# EAGLE design Adafruit ItsyBitsy ESP32 (EAGLE 9.6.2)
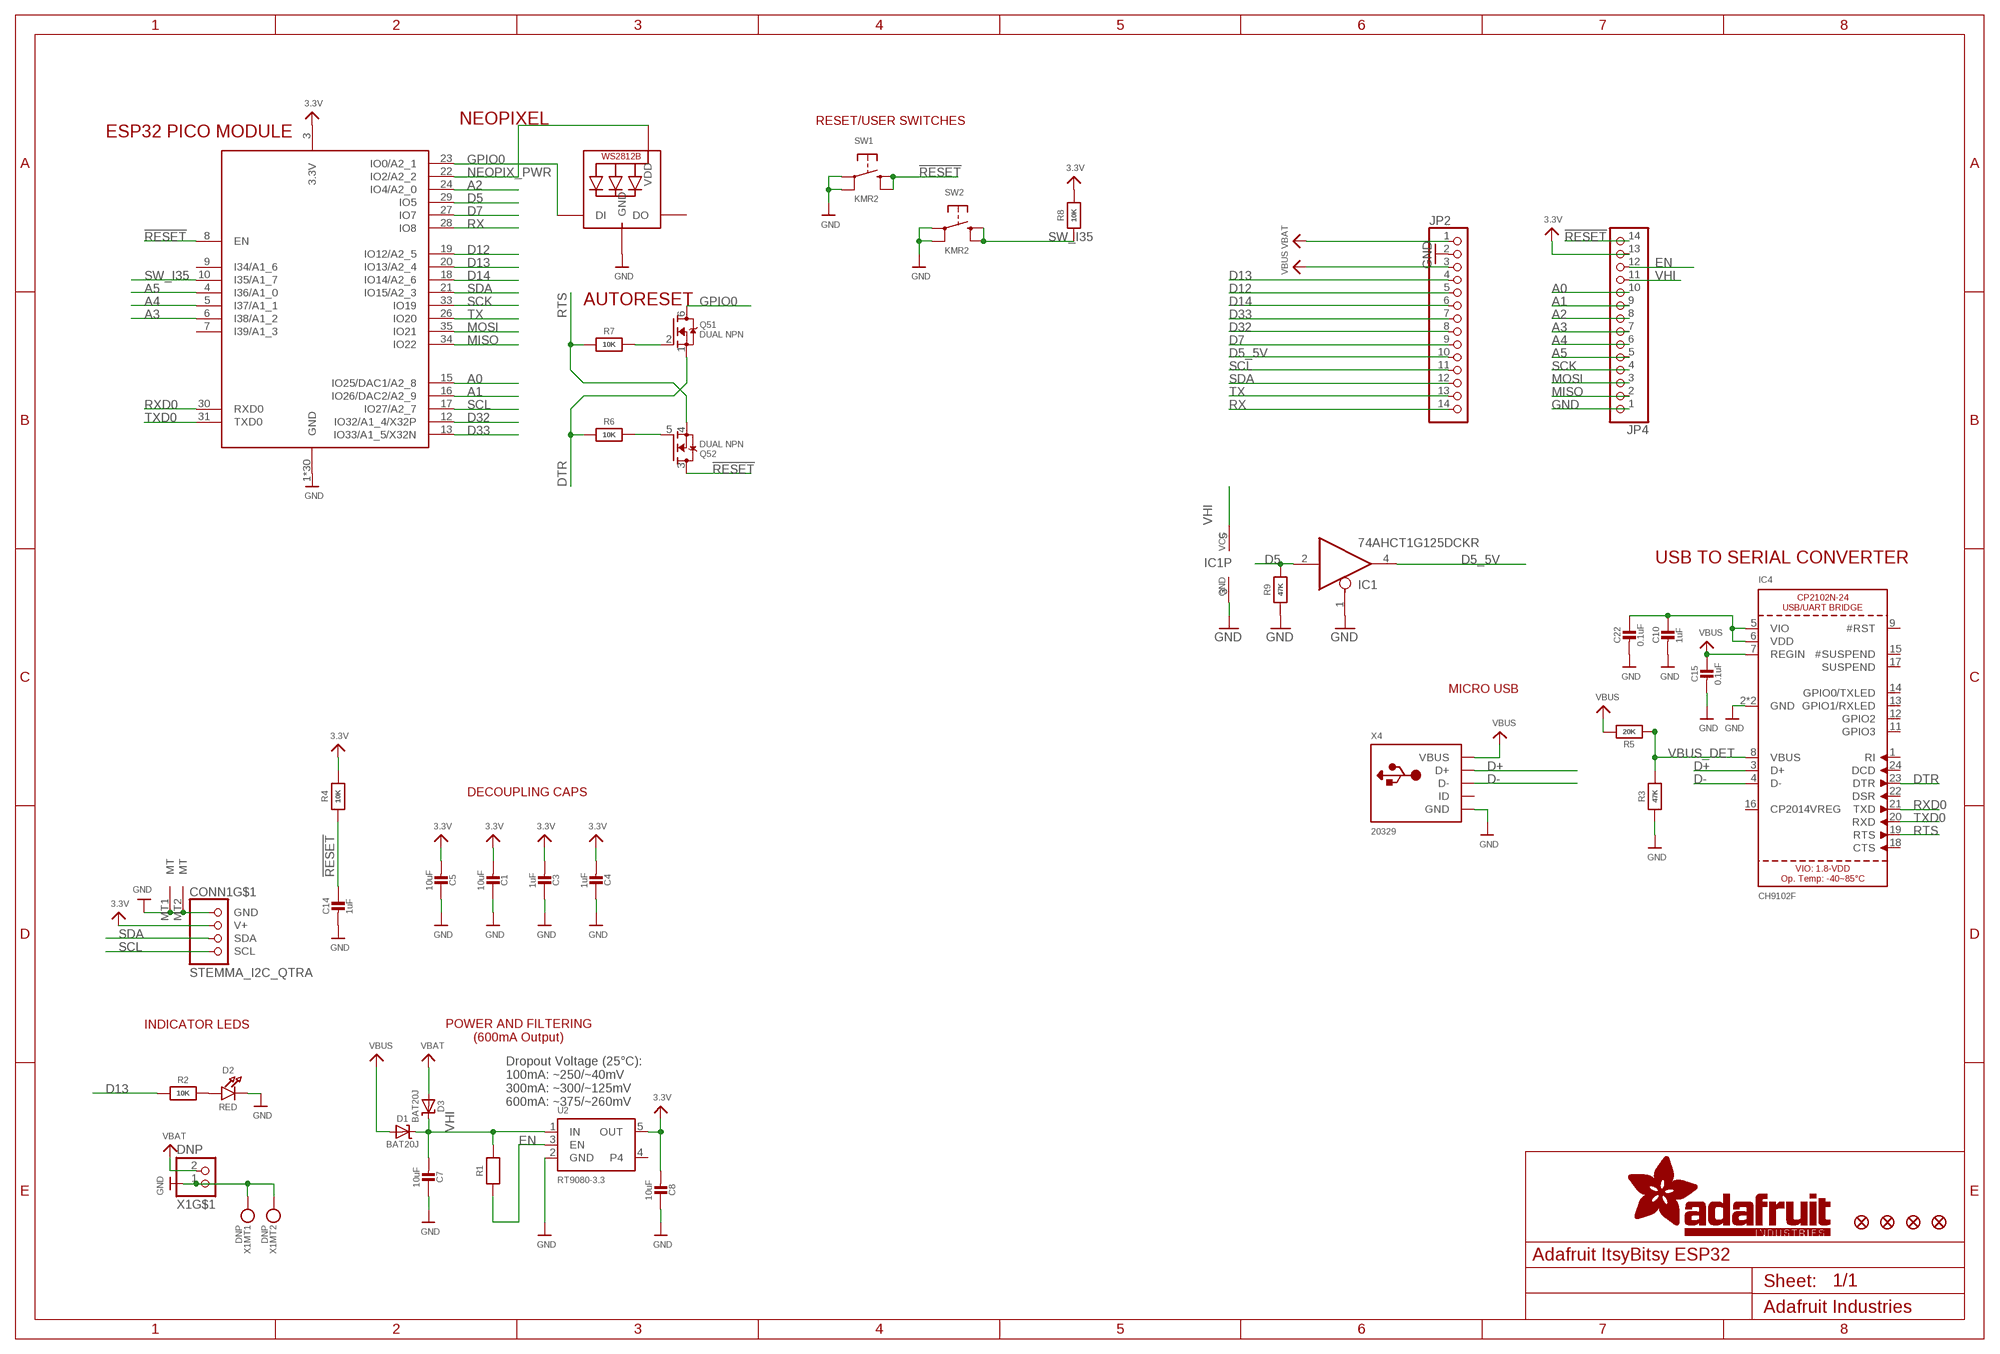
[diagram p0: schematic, sheet 1]

## Parts
C1  10uF  CAP_CERAMIC0805-NOOUTLINE  [0805-NO]
C3  1uF  CAP_CERAMIC0603_NO  [0603-NO]
C4  1uF  CAP_CERAMIC0603_NO  [0603-NO]
C5  10uF  CAP_CERAMIC0805-NOOUTLINE  [0805-NO]
C7  10uF  CAP_CERAMIC0805-NOOUTLINE  [0805-NO]
C8  10uF  CAP_CERAMIC0805-NOOUTLINE  [0805-NO]
C10  1uF  CAP_CERAMIC0603_NO  [0603-NO]
C14  1uF  CAP_CERAMIC0603_NO  [0603-NO]
C15  0.1uF  CAP_CERAMIC0603_NO  [0603-NO]
C22  0.1uF  CAP_CERAMIC0603_NO  [0603-NO]
CONN1  STEMMA_I2C_QTRA  [JST_SH4_RA]
D1  BAT20J  DIODE-SCHOTTKYSOD-323  [SOD-323]
D2  RED  LED0603_NOOUTLINE  [CHIPLED_0603_NOOUTLINE]
D3  BAT20J  DIODE-SCHOTTKYSOD-323  [SOD-323]
FID1  FIDUCIAL_1MM  [FIDUCIAL_1MM]
FID2  FIDUCIAL_1MM  [FIDUCIAL_1MM]
FID3  FIDUCIAL_1MM  [FIDUCIAL_1MM]
FID4  FIDUCIAL_1MM  [FIDUCIAL_1MM]
IC1  74AHCT1G125DCKR  74AHC1G125DCK  [SC70-5]
IC4  CH9102F  CP2102N-24  [QFN24_4MM_SMSC]
JP2  HEADER-1X14  [1X14_ROUND70]
JP4  HEADER-1X14  [1X14_ROUND70]
LED2  WS2812B_SK6805_1515  [SK6805_1515]
Q5  DUAL NPN  MOSFET-N_DUAL  [SOT363]
R1  10K  RESISTOR_0603_NOOUT  [0603-NO]
R2  10K  RESISTOR_0603_NOOUT  [0603-NO]
R3  47K  RESISTOR_0603_NOOUT  [0603-NO]
R4  10K  RESISTOR_0603_NOOUT  [0603-NO]
R5  20K  RESISTOR_0603_NOOUT  [0603-NO]
R6  10K  RESISTOR_0603_NOOUT  [0603-NO]
R7  10K  RESISTOR_0603_NOOUT  [0603-NO]
R8  10K  RESISTOR_0603_NOOUT  [0603-NO]
R9  47K  RESISTOR_0603_NOOUT  [0603-NO]
SW1  KMR2  SWITCH_TACT_SMT_RKB2  [BTN_RKB2_4.6X2.8]
SW2  KMR2  SWITCH_TACT_SMT_RKB2  [BTN_RKB2_4.6X2.8]
U2  RT9080-3.3  VREG_SOT23-5  [SOT23-5]
X1  DNP  CON_JST_PH_2PIN_MT_BATT  [JSTPH2_BATT]
X3  ESP32-PICO-MINI-02MINI  [ESP32-PICO-MINI]
X4  20329  USB_SLIM  [4UCONN_20329_SLIM]

## Nets
3.3V [power]: C1.2 C3.2 C4.2 C5.2 C8.2 CONN1.2(V+) JP4.13 R4.2 R8.2 U2.5(OUT) X3.3(3.3V)
3.45V [power]: C10.1 C22.1 IC4.5(VIO) IC4.6(VDD)
!RESET: C14.1 JP4.14 Q5.3(2:D) R4.1 SW1.B'(S1) SW1.B(S) X3.8(EN)
A0: JP4.10 X3.15(IO25/DAC1/A2_8)
A1: JP4.9 X3.16(IO26/DAC2/A2_9)
A2: JP4.8 X3.24(IO4/A2_0)
A3: JP4.7 X3.6(I38/A1_2)
A4: JP4.6 X3.5(I37/A1_1)
A5: JP4.5 X3.4(I36/A1_0)
D5: IC1.2(I) R9.2 X3.29(IO5)
D5_5V: IC1.4(O) JP2.10
D7: JP2.9 X3.27(IO7)
D12: JP2.5 X3.19(IO12/A2_5)
D13: JP2.4 R2.1 X3.20(IO13/A2_4)
D14: JP2.6 X3.18(IO14/A2_6)
D32: JP2.8 X3.12(IO32/A1_4/X32P)
D33: JP2.7 X3.13(IO33/A1_5/X32N)
D+: IC4.3(D+) X4.D+
D-: IC4.4(D-) X4.D-
DTR: IC4.23(DTR) Q5.1(1:S) R6.1
EN: JP4.12 R1.1 U2.3(EN)
GND: C1.1 C3.1 C4.1 C5.1 C7.1 C8.1 C10.2 C14.2 C15.2 C22.2 CONN1.1(GND) CONN1.MT1(MT) CONN1.MT2(MT) D2.C IC1.1(OE) IC1.3(GND) IC4.2(GND) IC4.THERM(GND) JP2.2 JP4.1 LED2.4(GND) R3.1 R9.1 SW1.A'(P1) SW1.A(P) SW2.A'(P1) SW2.A(P) U2.2(GND) X1.1 X1.NC1 X1.NC2 X3.1(GND) X3.2(GND) X3.11(GND) X3.14(GND) X3.36(GND) X3.37(GND) X3.38(GND) X3.39(GND) X3.40(GND) X3.41(GND) X3.42(GND) X3.43(GND) X3.44(GND) X3.45(GND) X3.46(GND) X3.47(GND) X3.48(GND) X3.49(GND) X3.50(GND) X3.51(GND) X3.52(GND) X3.53(GND) X3.54(GND) X3.55(GND) X3.56(GND) X3.57(GND) X3.58(GND) X3.59(GND) X3.60(GND) X3.61(GND) X4.BASE@1(GND) X4.BASE@2(GND) X4.GND X4.SPRT@1(GND) X4.SPRT@2(GND) X4.SPRT@3(GND) X4.SPRT@4(GND)
GPIO0: LED2.1(DI) Q5.6(1:D) X3.23(IO0/A2_1)
MISO: JP4.2 X3.34(IO22)
MOSI: JP4.3 X3.35(IO21)
N$1: D2.A R2.2
N$7: Q5.5(2:G) R6.2
N$8: Q5.2(1:G) R7.2
NEOPIX_PWR: LED2.2(VDD) X3.22(IO2/A2_2)
RTS: IC4.19(RTS) Q5.4(2:S) R7.1
RX: JP2.14 X3.28(IO8)
RXD0: IC4.21(TXD) X3.30(RXD0)
SCK: JP4.4 X3.33(IO19)
SCL: CONN1.4(SCL) JP2.11 X3.17(IO27/A2_7)
SDA: CONN1.3(SDA) JP2.12 X3.21(IO15/A2_3)
SW_I35: R8.1 SW2.B'(S1) SW2.B(S) X3.10(I35/A1_7)
TX: JP2.13 X3.26(IO20)
TXD0: IC4.20(RXD) X3.31(TXD0)
VBAT [power]: D3.A JP2.1 X1.2
VBUS [power]: C15.1 D1.A IC4.7(REGIN) JP2.3 R5.2 X4.VBUS
VBUS_DET: IC4.8(VBUS) R3.2 R5.1
VHI [power]: C7.2 D1.C D3.C IC1.5(VCC) JP4.11 R1.2 U2.1(IN)
Unconnected: IC4.1(RI) IC4.9(#RST) IC4.11(GPIO3) IC4.12(GPIO2) IC4.13(GPIO1/RXLED) IC4.14(GPIO0/TXLED) IC4.15(#SUSPEND) IC4.16(CP2014VREG) IC4.17(SUSPEND) IC4.18(CTS) IC4.22(DSR) IC4.24(DCD) LED2.3(DO) U2.4 X3.7(I39/A1_3) X3.9(I34/A1_6) X4.ID

## Notes on the sheet
- NEOPIXEL | RESET/USER SWITCHES
- ESP32 PICO MODULE
- AUTORESET
- USB TO SERIAL CONVERTER
- MICRO USB
- DECOUPLING CAPS
- INDICATOR LEDS
- POWER AND FILTERING
  (600mA Output)
- Dropout Voltage (25°C):
  100mA: ~250/~40mV
  300mA: ~300/~125mV
  600mA: ~375/~260mV

## Library data of the parts
C1 C3-C5 C7 C8 C10 C14 C15 C22 = microbuilder:CAP_CERAMIC: Ceramic Capacitors For new designs, use the packages preceded by an '_' character since they are more reliable: The following footprints should be used on most boards: _0402 - Standard footprint for regular board layouts _0603 - Standard footprint for regular board layouts _0805 - Standard footprint for regular board layouts _1206 - Standard footprint for regular board layouts For extremely tight-pitch boards where space is at a premium, the following 'micro-pitch' footprints can be used (smaller pads, no silkscreen outline, etc.): _0402MP - Micro-pitch footprint for very dense/compact boards _0603MP - Micro-pitch footprint for very dense/compact boards _0805MP - Micro-pitch footprint for very dense/compact boards _1206MP - Micro-pitch footprint for very dense/compact boards
CONN1 = adafruit_electromech:STEMMA_I2C; LCSC: C145961
D1 D3 = microbuilder:DIODE-SCHOTTKY
D2 = microbuilder:LED: LED 0603 - 0603 Surface Mount Package 2mA: Green LED - Low Power (3.9mcd, 2ma, 1.7Vf) - Digikey: 475-2709-2-ND Orange LED - Low Power (9.8mcd, 2ma, 1.8Vf) - Digikey: 475-1194-2-ND Red LED - Low Power (5mcd, 2ma, 1.8Vf) - Digikey: 475-1195-2-ND Yellow LED - Low Power (7mcd, 2ma, 1.8Vf) - Digikey: 475-1196-2-ND 5mA: Blue LED - Low Power (17mcd, 5ma, 2.9Vf) - Digikey: LNJ937W8CRACT-ND 0805 - 0805 Surface Mount Package 2mA: Red LED (8.8mcd, 2mA, 1.8Vf, Clear) - Low Power [Digikey: 475-2510-1-ND] Green LED (5mcd, 2mA, 1.8Vf, Clear) - Low Power [Digikey: 475-2730-1-ND] Yellow LED (11.3mcd, 2mA, 1.8Vf, Clear) - Low Power [Digikey: 475-2555-1-ND] 20mA: Red LED (104mcd, 20mA, Diffused) - LS R976 [Digikey: 475-1278-6-ND] Red LED (12mcd, 20mA, 2.0Vf, Clear) - APT2012EC [Digikey: 754-1128-1-ND] Green LED (15mcd, 20mA, 2.2Vf, Clear) - APT2012GC [Digikey: 754-1131-1-ND] Orange LED (160mcd, 20mA, 2.1Vf, Clear) - APT2012SECK [Digikey: 754-1130-1-ND] 1206 - 1206 Surface Mount Package Green LED (26mcd, 20mA, Diffused) - LG N971 [Digikey: 475-1407-6-ND] Red LED (15mcd, 20mA, Diffused) - LH N974 [Digikey: 475-1416-6-ND] Cree - Cree High-Power Surface Mount LEDs XPEBWT-L1-0000-00D50 - White 111lm 350mA 2.9Vf 6200K 110° XTEAWT-00-0000-00000LEE3 - White 114lm 350mA 2.85Vf 5000K 115° Everlight - Everlight 45-21 Series Surface Mount LEDs 45-21/QK2C-B2832AC2CB2/2T - Warm White 2000mcd 20mA 3.25Vf 3050K 120° 45-21/LK2C-B38452C4CB2/2T - Nuetral White 2000mcd 20mA 3.25Vf 4150K 120° 45-21/LK2C-B50634C6CB2/2T - Cold White 2200mcd 20mA 3.25Vf 5650K 120° PLCC2 Reverse Mount LS T77K-J1L2-1-0-2-R18-Z - Red 11.25mcd 2mA 1.8Vf 630nm 120° LO T77K-L1M2-24-Z - Orange 19.6mcd 2mA 1.8Vf 606nm 120° LY T77K-K2M1-26-Z - Yellow 15.7mcd 2mA 1.8Vf 587nm 120°; ROT: 270
FID1-FID4 = microbuilder:FIDUCIAL: Fiducial Alignment Points Various fiducial points for machine vision alignment.; BOM: EXCLUDE
IC1 = 74xx-little-us:74*1G125: Single Bus Buffer Gate with 3-State Output
IC4 = microbuilder:CP2102N-24; JLC_ROTATION: 270
JP2 JP4 = microbuilder:HEADER-1X14
LED2 = microbuilder:WS2812B; LCSC: C2890035
Q5 = microbuilder:MOSFET-N_DUAL: Dual N-Channel MOSFET SOT363 (2.0x1.25mm) 2N7002PS - 60V, 320mA [Digikey: 568-5984-1-ND]; JLC_ROTATION: 0
R1-R9 = microbuilder:RESISTOR: Resistors For new designs, use the packages preceded by an '_' character since they are more reliable: The following footprints should be used on most boards: _0402 - Standard footprint for regular board layouts _0603 - Standard footprint for regular board layouts _0805 - Standard footprint for regular board layouts _1206 - Standard footprint for regular board layouts For extremely tight-pitch boards where space is at a premium, the following 'micro-pitch' footprints can be used (smaller pads, no silkscreen outline, etc.): _0402MP - Micro-pitch footprint for very dense/compact boards _0603MP - Micro-pitch footprint for very dense/compact boards _0805MP - Micro-pitch footprint for very dense/compact boards _1206MP - Micro-pitch footprint for very dense/compact boards
SW1 SW2 = adafruit_electromech:SWITCH_TACT_SMT: SMT Tact Switches RKB2 https://www.digikey.com/short/m027prz5
U2 = adafruit_power:VREG_SOT23-5: SOT23-5 Fixed Voltage Regulators Part Current Out V Out V In V Dropout θJA (°C/W) TJ (°C) Digikey Part No. ADP121 150mA 3.3V 3.4-5.5V 0.09V @ 150mA -- -- ADP121-AUJZ33R7CT-ND ADP121 150mA 3.0V 3.1-5.5V 0.09V @ 150mA -- -- ADP121-AUJZ30R7CT-ND ADP122 300mA 3.3V 3.4-5.5V 0.085V @ 300mA -- -- ADP122AUJZ-3.3-R7CT-ND ADP1712 300mA 3.3V 3.5-5.5V 0.17V @ 300mA -- -- ADP1712AUJZ-3.3-R7TR-ND AP7311 (Low Cost) 150mA 3.3V 3.5-6V 0.15V @ 150mA -- -- AP7311-33WG-7DICT-ND LD39015M18R 150mA 1.8V 1.9V-5.5V 0.08V @ 100mA -- -- 497-6977-1-ND LP2985A-33DBVR 150mA 3.3V 3.3-16V 0.28V @ 150mA 206 150 296-18479-1-ND MCP1824T-3302E/OT 300mA 3.3V 3.5V-6V 0.2V @ 300mA -- -- MCP1824T-3302E/OTCT-ND MIC5205-2.5YM5 TR 150mA 2.5V 2.7-16V 0.165V @ 150mA -- -- 576-1257-2-ND MIC5205-3.0YM5 TR 150mA 3.0V 3.2V-16V 0.165V @ 150mA -- -- 576-1258-2-ND MIC5205-3.3YM5 TR 150mA 3.3V 3.5V-16V 0.165V @ 150mA -- -- 576-1259-2-ND TPS780330220 150mA 3.3V+2.2V 3.6-5.5V 250mV Max -- -- 296-23332-1-ND TDA3663/N1,135 100mA 3.3V 3.5-45V 0.18V @ 50mA -- -- 568-5343-1-ND Max operating temp can be calculated using θJA, TJ (max junction temperature), and power in watts. Set the "Maximum Ambient Temperature" until it reaches TJ ("Max Junction Temperature"), which is the absolute limit for safe use of the regulator: Heat Sink Temperature Calculator <http://www.daycounter.com/Calculators/Heat-Sink-Temperature-Calculator.phtml> For example, With 12V source into a 3.3V LP2985 and a 30mA load, we are dissipating (12V-3.3V) * 0.03A = 0.261W. With a θJA of 206 °C/W, a TJ of 150°C, and 261mW we can safely use the chip without a heat sink up to 75°C (=147.1°C Junction Temperature).; JLC_ROTATION: 0
X1 = adafruit_electromech:CON_JST_PH_2PIN_MT; LCSC: C47647
X3 = adafruit_wireless:ESP32-PICO-MINI-02
X4 = adafruit_electromech:USB: USB Connectors USBMINIB - Surface Mount Female Mini-B USB Connector 4UConnector: 06564

## Net classes
1 power: width 0.305 mm

## Board
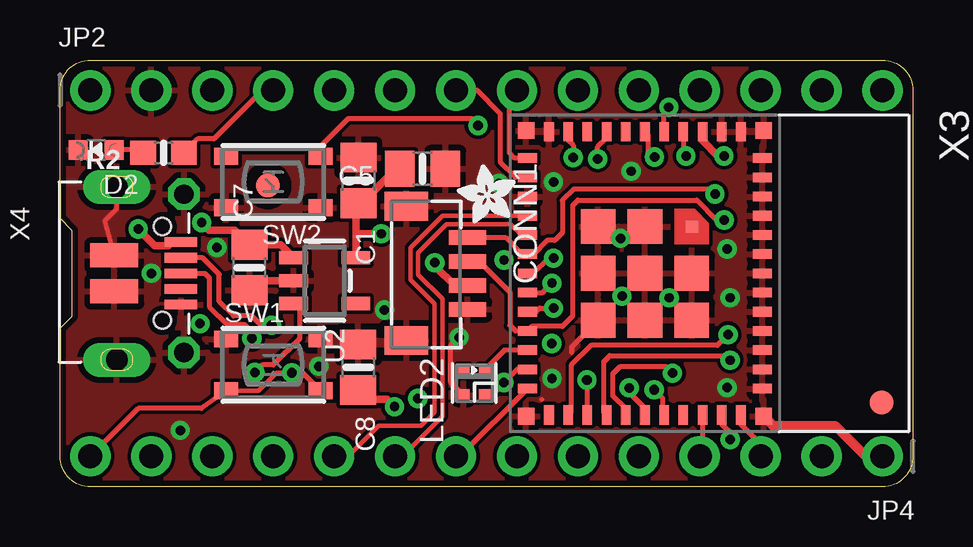
[diagram p1: board, top side]
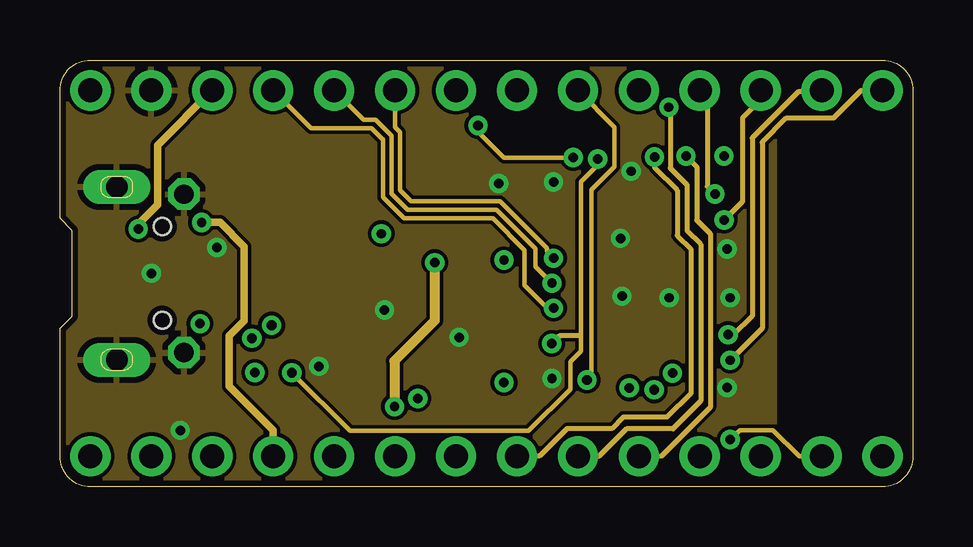
[diagram p2: board, inner layer Route2]
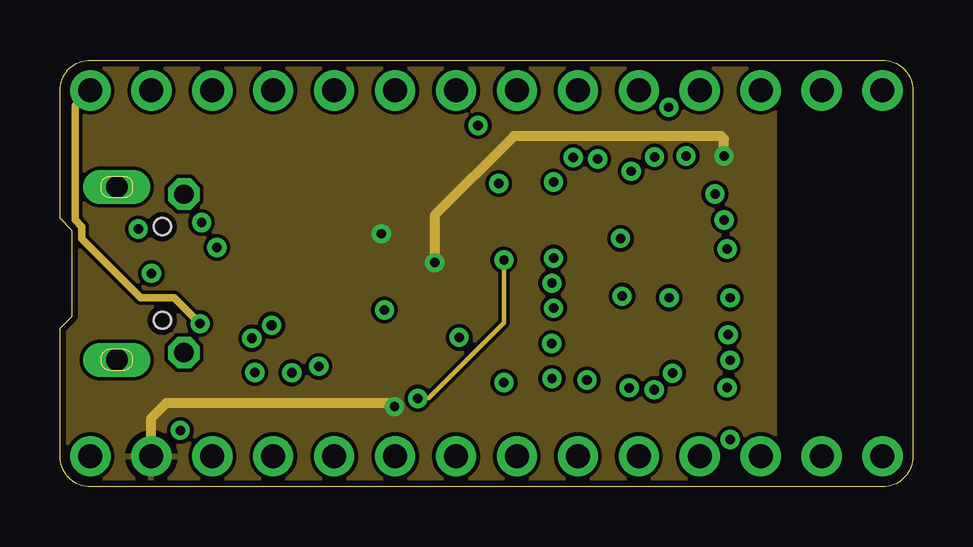
[diagram p3: board, inner layer Route15]
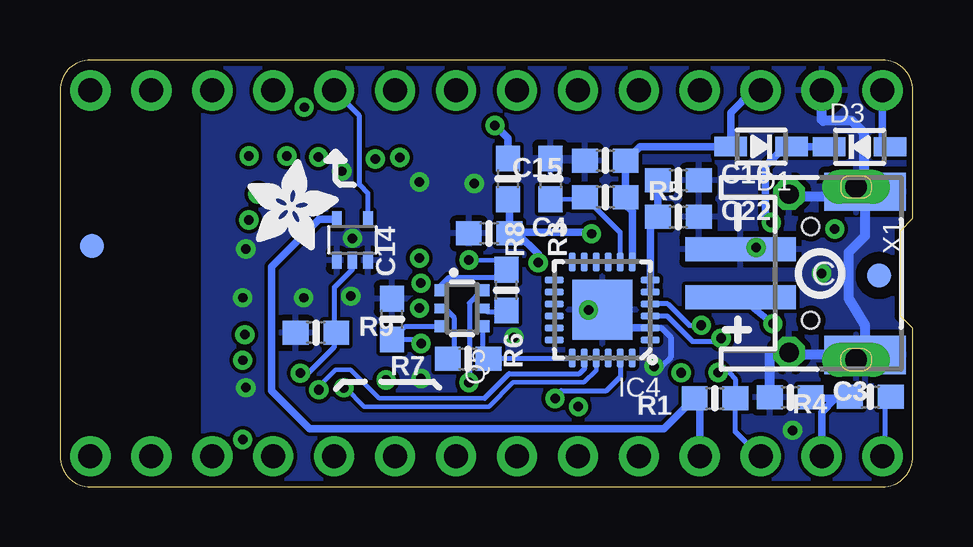
[diagram p4: board, bottom side, seen from below]

Size 35.56 x 17.78 mm. Coordinates in mm from the lower left corner, seen from the top.
Outline: 0,11.18 0,16.51 arc-90 1.27,17.78 34.29,17.78 arc-90 35.56,16.51 35.56,1.27 arc-90 34.29,0 1.27,0 arc-90 0,1.27 0,6.6 0.51,7.11 0.51,10.67 0,11.18
Copper layers (1+2*15+16): Top 0.035mm / dielectric 0.2mm / Route2 0.035mm / dielectric 1.45mm / Route15 0.035mm / dielectric 0.2mm / Bottom 0.035mm
Design rules "adafruit_4layer *": minimum track width 7mil, minimum drill 15.5mil, track to track 6mil, track to pad 6mil, pad to pad 6mil, via to via 6mil, smd to smd 6mil, copper to edge 10mil, drill to drill 8mil, minimum pad ring 10mil, minimum via ring 8mil, stop-mask expansion 2mil, vias tented up to drill 20mil, thermal gap 10mil

### Footprints (pad centres in the part's own frame; a part is rotated, then mirrored left to right if it is on the bottom)
0805-NO = smd 1.24 x 1.5: 1 -0.95,0; 2 0.95,0
0603-NO = smd 1.075 x 1: 1 -0.85,0; 2 0.85,0
JST_SH4_RA = smd 0.6 x 1.55: 1 1.5,0.924; 2 0.5,0.924; 3 -0.5,0.924; 4 -1.5,0.924 | smd 1.2 x 1.8: MT1 -2.8,-1.624; MT2 2.8,-1.624
SOD-323 = smd 1.35 x 0.8: A 1.27,0; C -1.27,0
CHIPLED_0603_NOOUTLINE = smd 0.8 x 0.8: A 0,-0.75; C 0,0.75
FIDUCIAL_1MM = smd 1 x 1: 1 0,0
SC70-5 = smd 0.4 x 0.7: 1 -0.65,-0.85; 2 0,-0.85; 3 0.65,-0.85; 4 0.65,0.85; 5 -0.65,0.85
QFN24_4MM_SMSC = smd 0.8 x 0.28: 1 -2,1.25; 2 -2,0.75; 3 -2,0.25; 4 -2,-0.25; 5 -2,-0.75; 6 -2,-1.25; 13 2,-1.25; 14 2,-0.75; 15 2,-0.25; 16 2,0.25; 17 2,0.75; 18 2,1.25 | smd 0.28 x 0.8: 7 -1.25,-2; 8 -0.75,-2; 9 -0.25,-2; 10 0.25,-2; 11 0.75,-2; 12 1.25,-2; 19 1.25,2; 20 0.75,2; 21 0.25,2; 22 -0.25,2; 23 -0.75,2; 24 -1.25,2 | smd 2.5 x 2.5: THERM 0,0
1X14_ROUND70 = drill 1 pad 1.676: 1 -16.51,0; 2 -13.97,0; 3 -11.43,0; 4 -8.89,0; 5 -6.35,0; 6 -3.81,0; 7 -1.27,0; 8 1.27,0; 9 3.81,0; 10 6.35,0; 11 8.89,0; 12 11.43,0; 13 13.97,0; 14 16.51,0
SK6805_1515 = smd 0.5 x 0.5: 1 -0.5,-0.45; 2 0.5,-0.45; 3 0.5,0.45; 4 -0.5,0.45
SOT363 = smd 0.5 x 0.5: 1 -0.75,-0.9; 3 0.75,-0.9; 4 0.75,0.9; 6 -0.75,0.9 | smd 0.4 x 0.5: 2 0,-0.9; 5 0,0.9
BTN_RKB2_4.6X2.8 = smd 1 x 0.7: A 1.973,1.075; A' -1.973,1.075; B 1.973,-1.075; B' -1.973,-1.075
SOT23-5 = smd 0.55 x 1.2: 1 -0.95,-1.3; 2 0,-1.3; 3 0.95,-1.3; 4 0.95,1.3; 5 -0.95,1.3
JSTPH2_BATT = smd 1 x 4.6: 1 -1,-2.303; 2 1,-2.303 | smd 1.6 x 3.4: NC1 -3.4,2.897; NC2 3.4,2.897
ESP32-PICO-MINI = smd 0.8 x 0.4: 1 -5.9,4; 2 -5.9,3.2; 3 -5.9,2.4; 4 -5.9,1.6; 5 -5.9,0.8; 6 -5.9,0; 7 -5.9,-0.8; 8 -5.9,-1.6; 9 -5.9,-2.4; 10 -5.9,-3.2; 11 -5.9,-4; 25 5.9,-4; 26 5.9,-3.2; 27 5.9,-2.4; 28 5.9,-1.6; 29 5.9,-0.8; 30 5.9,0; 31 5.9,0.8; 32 5.9,1.6; 33 5.9,2.4; 34 5.9,3.2; 35 5.9,4 | smd 0.4 x 0.8: 12 -4.8,-4.9; 13 -4,-4.9; 14 -3.2,-4.9; 15 -2.4,-4.9; 16 -1.6,-4.9; 17 -0.8,-4.9; 18 0,-4.9; 19 0.8,-4.9; 20 1.6,-4.9; 21 2.4,-4.9; 22 3.2,-4.9; 23 4,-4.9; 24 4.8,-4.9; 36 4.8,4.9; 37 4,4.9; 38 3.2,4.9; 39 2.4,4.9; 40 1.6,4.9; 41 0.8,4.9; 42 0,4.9; 43 -0.8,4.9; 44 -1.6,4.9; 45 -2.4,4.9; 46 -3.2,4.9; 47 -4,4.9; 48 -4.8,4.9 | smd 1.45 x 1.45: 49 0,0; 54 -1.95,0; 55 -1.95,-1.95; 56 0,-1.95; 57 1.95,-1.95; 58 1.95,0; 59 1.95,1.95; 60 0,1.95 | smd 0.7 x 0.7: 50 5.95,4.95; 51 5.95,-4.95; 52 -5.95,-4.95; 53 -5.95,4.95 | smd 0.5 x 0.5: 61 -1.95,1.95
4UCONN_20329_SLIM = smd 1 x 2: BASE@1 -0.75,-1.492; BASE@2 0.75,-1.492 | smd 0.4 x 1.35: D+ 0,1.283; D- -0.65,1.283; GND 1.3,1.283; ID 0.65,1.283; VBUS -1.3,1.283 | drill 0.8 pad 1.27 octagon: SPRT@1 -3.3,1.408; SPRT@2 3.3,1.408 | drill 0.9 pad 1.27 long: SPRT@3 -3.6,-1.392; SPRT@4 3.6,-1.392 | hole 0.7: -1.95,0.508; 1.95,0.508

### Placement (x,y rotation side)
C1  12.45,12.76 270 top
C3  5.12,3.72 0 bottom
C4  17.67,10.55 0 bottom
C5  15.11,13.25 180 top
C7  7.9,9.13 90 top
C8  12.43,4.98 270 top
C10  9.78,12.76 0 bottom
C14  21.72,6.99 90 bottom
C15  12.83,13.59 180 bottom
C22  9.78,11.24 0 bottom
CONN1  16.07,8.89 270 top
D1  6.32,14.17 180 bottom
D2  1.51,14.03 90 top
D3  2.22,14.16 0 bottom
E$1  [ADAFRUIT_2.5MM]  18.99,10.99 90 top
E$2  [ADAFRUIT_3.5MM]  27.75,9.84 0 bottom
FID1  34.25,3.52 0 top
FID2  8.66,12.55 0 top
FID3  34.23,10.03 0 bottom
FID4  1.41,8.8 0 bottom
IC1  23.37,10.29 0 bottom
IC4  12.95,7.37 180 bottom
JP2  17.78,16.51 0 top
JP4  17.78,1.27 180 top
LED2  17.27,4.32 90 top
PLABEL0  [PLABEL0]  0.38,2.92 0 top
PLABEL1  [PLABEL1]  3.05,2.79 0 top
PLABEL2  [PLABEL2]  5.59,2.86 0 top
PLABEL3  [PLABEL3]  7.87,2.86 0 top
PLABEL4  [PLABEL4]  10.67,2.79 0 top
PLABEL5  [PLABEL5]  13.21,2.86 0 top
PLABEL6  [PLABEL6]  15.68,2.86 0 top
PLABEL7  [PLABEL7]  0.25,15.05 0 top
PLABEL8  [PLABEL8]  3.3,15.05 0 top
PLABEL9  [PLABEL9]  5.08,15.05 0 top
PLABEL10  [PLABEL10]  8.19,14.99 0 top
PLABEL11  [PLABEL11]  10.79,14.99 0 top
PLABEL12  [PLABEL12]  13.21,14.73 0 top
PLABEL13  [PLABEL13]  15.68,14.8 0 top
PLABEL14  [PLABEL14]  17.46,14.86 0 top
PLABEL15  [PLABEL15]  17.4,2.86 0 top
PLABEL16  [PLABEL16]  4.57,4.25 0 top
PLABEL17  [PLABEL17]  5.84,12.7 0 top
PLABEL18  [PLABEL18]  16.89,6.22 0 top
PLABEL19  [PLABEL19]  14.16,4.7 0 top
PLABEL20  [PLABEL20]  18.35,7.11 90 top
PLABEL21  [PLABEL21]  19.05,2.67 90 bottom
PLABEL22  [PLABEL22]  21.59,2.54 90 bottom
PLABEL23  [PLABEL23]  24.13,2.54 90 bottom
PLABEL24  [PLABEL24]  26.67,2.54 90 bottom
PLABEL25  [PLABEL25]  29.21,2.54 90 bottom
PLABEL26  [PLABEL26]  31.75,2.54 90 bottom
PLABEL27  [PLABEL27]  34.29,2.54 90 bottom
PLABEL28  [PLABEL28]  21.59,14.54 90 bottom
PLABEL29  [PLABEL29]  24.13,14.22 90 bottom
PLABEL30  [PLABEL30]  26.8,13.53 90 bottom
PLABEL31  [PLABEL31]  29.21,13.14 90 bottom
PLABEL32  [PLABEL32]  31.75,13.97 90 bottom
PLABEL33  [PLABEL33]  34.29,13.91 90 bottom
PLABEL34  [PLABEL34]  16.51,2.54 90 bottom
PLABEL35  [PLABEL35]  11.43,2.54 90 bottom
PLABEL36  [PLABEL36]  13.97,2.54 90 bottom
PLABEL37  [PLABEL37]  19.05,13.84 90 bottom
PLABEL38  [PLABEL38]  17.21,14.86 0 bottom
PLABEL39  [PLABEL39]  14.67,14.73 0 bottom
PLABEL40  [PLABEL40]  12.13,14.8 0 bottom
PLABEL41  [PLABEL41]  9.72,14.8 0 bottom
PLABEL42  [PLABEL42]  21.15,12.57 0 bottom
PLABEL43  [PLABEL43]  21.97,5.21 0 bottom
PLABEL44  [PLABEL44]  30.73,9.84 0 bottom
Q5  18.8,7.43 270 bottom
R1  8.26,3.68 180 bottom
R2  4.32,13.92 180 top
R3  15.11,12.83 270 bottom
R4  1.78,3.75 180 bottom
R5  12.83,12.06 0 bottom
R6  16.95,8.19 270 bottom
R7  18.54,5.33 180 bottom
R8  16.89,12.83 270 bottom
R9  24.89,6.41 0 bottom
SW1  8.89,5.08 0 top
SW2  8.89,12.7 180 top
U2  11.04,8.59 270 top
U$16  [PCBFEAT-REV-040]  3.87,8.89 0 bottom
X1  4.89,8.89 270 bottom
X3  24.38,8.89 270 top
X4  3.76,8.89 270 top

### Tracks (layer width: path | path; a pad name or v marks a point on that pad's centre or on a via)
3.3V  (via drill 0.39)
  Top 0.305: X3.3 26.78,14.43 27.43,13.78 v27.68,13.78 | v15.62,9.34 15.62,9.21 16.48,8.35 16.48,8.39 CONN1.2 | C5.2 13.88,12.96 13.72,12.96 12.57,11.81 C1.2 12.46,11.8 12.34,11.67 U2.5 12.34,10.36 12.52,10.54 v13.4,10.54 | v13.95,3.33 13.63,3.65 12.81,3.65 C8.2
  Route2 0.406: v15.62,9.34 15.62,6.92 13.95,5.25 v13.95,3.33
  Route15 0.406: v27.68,13.78 27.68,14.48 27.56,14.61 18.92,14.61 15.62,11.3 v15.62,9.34 | JP4.13 3.81,2.86 4.45,3.49 13.79,3.49 v13.95,3.33
  Bottom 0.305: 2.63,3.68 R4.2 3.17,3.75 3.24,3.68 | 3.24,3.68 3.81,3.11 JP4.13 | C3.2 4.23,3.68 3.24,3.68 | C4.2 16.5,10.55 15.62,9.68 v15.62,9.34 | C4.2 16.77,10.6 13.46,10.6 v13.4,10.54 | R8.2 16.82,11.9 C4.2
  pour Route15: 0.13,17.78 29.78,17.78 29.78,-0.06 0.13,-0.06 0.13,17.72
3.45V
  Bottom 0.305: IC4.5 IC4.6 10.95,10.91 C22.1 C10.1
!RESET  (via drill 0.39, 0.4)
  Top 0.178: SW1.B' 8.28,4 9.03,4.75 v9.66,4.75
  Top 0.203: SW1.B' 5.89,3.26 3.26,3.26 JP4.14 | v22.42,13.65 22.42,14.16 22.78,14.53 X3.8 | SW1.B 10.12,4.75 v9.66,4.75
  Route2 0.178: v22.42,13.65 22.42,13.4 21.72,12.7 21.72,6.29 21.72,5.65 21.27,5.21 21.27,4.06 19.54,2.32 12.09,2.32 v9.66,4.75
  Route2 0.203: v20.5,5.97 20.82,6.29 21.72,6.29
  Bottom 0.203: Q5.3 21.17,6.68 C14.1 20.67,6.13 v20.5,5.97 | R4.1 1.18,3.49 1.18,1.36 JP4.14
A0
  Top 0.178: JP4.10 12,1.27 13.27,2.54 15.05,2.54 15.61,3.1 15.61,7.63 14.61,8.63 14.61,9.95 15.94,11.29 X3.15
A1
  Top 0.178: X3.16 19.23,10.49 18.79,10.93 16.11,10.93 14.94,9.75 14.94,8.84 15.94,7.83 15.94,2.93 14.28,1.27 JP4.9
A2
  Top 0.203: JP4.8 16.66,1.27 X3.24
A3  (via drill 0.39)
  Top 0.203: X3.6 24.51,14.66 24.51,14.01 v24.78,13.74
  Route2 0.178: v24.78,13.74 24.78,13.29
  Route2 0.203: 24.78,13.29 25.74,12.34 25.74,10.47 26.3,9.91 26.3,3.88 25.31,2.9 23.48,2.9 23,2.43 21.14,2.43 19.98,1.27 JP4.7
A4  (via drill 0.39)
  Top 0.203: v25.38,15.81 25.18,15.62 X3.5
  Route2 0.203: JP4.6 22.48,1.27 23.62,2.41 25.55,2.41 26.71,3.58 26.71,10.1 26.14,10.67 26.14,12.57 25.44,13.27 25.44,15.75 v25.38,15.81
A5  (via drill 0.39)
  Top 0.203: X3.4 25.98,13.89 v26.1,13.78
  Route2 0.178: JP4.5 25.08,1.27
  Route2 0.203: v26.1,13.78 26.54,13.34 26.54,11.11 27.11,10.54 27.11,3.3 25.08,1.27
D5  (via drill 0.39)
  Top 0.203: X3.29 23.58,3.24 23.05,3.78 23.05,4.7 23.37,5.02 25.25,5.02 v25.54,4.73
  Bottom 0.178: v25.54,4.73 25.22,4.73 | R9.2 24.13,6.5
  Bottom 0.203: 25.22,4.73 24.13,5.82 24.13,6.5 24.13,8.3 23.37,9.06 IC1.2
D5_5V
  Bottom 0.203: IC1.4 22.72,12.22 23.1,12.6 23.1,15.48 JP2.10
D7  (via drill 0.4)
  Top 0.203: X3.27 21.98,4.43 v21.97,4.45
  Route2 0.178: JP2.9 23.11,14.99 23.11,13.34 22.16,12.38 22.16,4.64 v21.97,4.45
D12  (via drill 0.39)
  Top 0.203: X3.19 20.12,8.09 v20.51,8.48
  Route2 0.178: v20.51,8.48 19.82,9.18 19.82,9.91 18.19,11.53 14.5,11.53 13.82,12.21 13.82,14.62 13.16,15.28 12.66,15.28 JP2.5
D13  (via drill 0.39)
  Top 0.203: X3.20 19.85,7.29 20,7.44 v20.57,7.44 | JP2.4 8.45,16.51 6.43,14.49 5.74,14.49 R2.1
  Route2 0.178: 20.32,7.44 19.37,8.39 19.37,9.86 18.05,11.18 14.35,11.18 13.46,12.06 13.46,14.48 13.44,14.48 12.99,14.93 10.47,14.93 JP2.4
  Route2 0.203: v20.57,7.44 20.32,7.44
D14  (via drill 0.39)
  Top 0.203: v20.57,9.53 20.38,9.53 19.75,8.89 X3.18
  Route2 0.178: v20.57,9.53 20.3,9.8 20.3,9.93 18.34,11.89 14.65,11.89 14.17,12.36 14.17,14.77 13.97,14.98 JP2.6
D32
  Top 0.203: X3.12 18.95,13.69 18.73,13.91 18.73,16.19 JP2.8
D33
  Top 0.203: JP2.7 17.4,16.51 18.35,15.56 18.35,13.53 18.99,12.89 X3.13
D+  (via drill 0.4)
  Top 0.203: X4.D+ 6.04,8.89 6.22,8.71 6.22,7.5 6.96,6.76 7.68,6.76 8.13,6.32 8.13,6.31 v8,6.19
  Bottom 0.203: IC4.3 10.26,7.12 9.2,6.06 8.13,6.06 v8,6.19
D-  (via drill 0.4)
  Top 0.203: v8.82,6.73 8.38,6.73 7.99,7.12 7.24,7.12 6.64,7.71 6.64,8.85 5.95,9.54 X4.D-
  Bottom 0.203: v8.82,6.73 9.33,6.73 10.22,7.62 IC4.4
DTR  (via drill 0.39, 0.4)
  Route15 0.178: v18.51,9.45 18.51,6.83 15.37,3.68 v14.92,3.68
  Bottom 0.178: v18.51,9.45 16.95,9.45 R6.1
  Bottom 0.203: IC4.23 12.2,4.57 12.78,4 14.67,4 14.92,3.75 v14.92,3.68 | Q5.1 19.7,8.37 19.34,8.72 16.64,8.72 R6.1
EN  (via drill 0.4)
  Top 0.203: v8.13,4.76 8.45,5.08 8.89,5.08 9.99,6.17 9.99,7.38 U2.3
  Bottom 0.203: JP4.12 6.39,1.27 7.41,2.29 R1.1 7.41,4.48 7.68,4.76 v8.13,4.76
GND  (via drill 0.39)
  Top 0.178: X4.SPRT@3 2.37,11.65 2.27,11.47 | X4.BASE@1 1.87,11.08 2.37,11.57 | X4.SPRT@4 2.29,5.3 2.29,5.78 1.78,5.78 2.27,5.29 X4.SPRT@4
  Top 0.203: 20.08,3.64 20.09,3.64 | X3.51 19.43,3 | X3.57 21.34,5.84 21.34,5.58 | LED2.4 16.28,4.36 16.28,5.87 v16.64,6.22
  Top 0.305: C7.1 8.18,8.18 8.59,8.59 U2.2
  Top 0.406: X3.50 29.73,2.54 32.32,2.54 33.59,1.27 JP4.1
  Bottom 0.178: 1.94,12.49 X4.SPRT@3
  Bottom 0.254: IC4.2 10.49,6.62 10.1,6.22 10.1,5.4 10.48,5.02 v10.79,5.02
  Bottom 0.305: IC4.THERM v13.53,7.37 12.78,6.62 IC4.2
  Bottom 0.406: C3.1 5.97,5.5 5.88,5.59 X4.SPRT@2 4.56,5.49 X1.NC2 1.99,6.7 2.69,7.86 2.69,9.75 1.99,10.45 X1.NC1 | X1.NC1 1.94,12.49 | X1.NC1 1.93,12.1 4.57,12.1 X4.SPRT@1 | X1.NC1 2.06,12.35 2.06,14.76 2.54,15.24 3.75,15.24 3.81,15.3 JP2.2
  other vias: 20.57,12.7 27.94,7.87 27.81,9.91 18.29,12.64 3.81,8.89 27.81,4.13 5.02,2.35 25.4,7.87 23.43,7.94 23.37,10.35 23.81,13.14 20.51,4.51 6.54,9.97
  pour Bottom: 0,17.78 29.59,17.84 29.59,0 0,0
  pour Top: 0,17.78 29.59,17.78 29.59,0 0,0
  pour Route2: 0.13,17.78 29.78,17.78 29.78,-0.06 0.13,-0.06 0.13,17.72
GPIO0  (via drill 0.4)
  Top 0.203: X3.23 19.06,4.89 v18.51,4.34 17.99,3.82 LED2.1
  Bottom 0.203: Q5.6 17.96,8.18 18.49,7.65 18.49,4.36 v18.51,4.34
MISO  (via drill 0.39)
  Top 0.203: X3.34 27.58,2.61 27.94,2.25 v27.94,1.97
  Route2 0.178: v27.94,1.97 28.33,2.36 29.73,2.36 30.82,1.27 JP4.2
MOSI
  Top 0.203: X3.35 28.38,2.6 29.21,1.78 JP4.3
N$1
  Top 0.203: R2.2 3.35,14.03 D2.A
N$7
  Bottom 0.203: Q5.5 17.76,7.29 16.93,7.29 R6.2
N$8
  Bottom 0.203: Q5.2 19.51,7.43 19.14,7.06 19.14,5.59 R7.2
NEOPIX_PWR
  Top 0.203: X3.22 18.53,5.69 17.72,4.88 LED2.2
RTS
  Bottom 0.203: IC4.19 14.22,5.35 17.58,5.35 17.95,5.71 | 17.95,5.71 17.95,6.63 Q5.4 | 17.95,5.71 17.95,5.59 R7.1
RX  (via drill 0.39)
  Top 0.203: X3.28 22.66,3.12 22.66,5.19 22.92,5.46 27.75,5.46 v27.94,5.27
  Route2 0.203: v27.94,5.27 29.27,6.6 29.27,14.35 30.29,15.37 32.26,15.37 33.4,16.51 JP2.14
RXD0  (via drill 0.4)
  Top 0.203: X3.30 24.38,3.27 23.73,3.93 v23.73,4.12
  Bottom 0.178: v23.73,4.12 23.66,4.12 22.88,3.34 17.68,3.34 16.67,4.35 13.71,4.35 13.2,4.86 IC4.21
SCK
  Top 0.203: X3.33 26.78,1.38 JP4.4
SCL  (via drill 0.4)
  Top 0.203: v27.3,12.19 27.09,12.4 21.42,12.4 20.95,11.93 20.95,10.58 20.63,10.26 20.31,10.26 19.74,9.69 X3.17 19.27,9.69 18.57,10.39 CONN1.4
  Route2 0.203: v27.3,12.19 26.99,12.51 26.99,16.19 JP2.11
SDA  (via drill 0.39)
  Top 0.203: v27.69,11.11 27.37,11.11 26.54,11.94 21.59,11.94 21.38,11.73 21.38,7.11 20.95,6.68 19.67,6.68 X3.21 18.99,6.49 18.75,6.73 18.75,8.11 17.47,9.39 CONN1.3
  Route2 0.178: 29.21,16.13 JP2.12
  Route2 0.203: v27.69,11.11 28.45,11.87 28.45,15.37 29.21,16.13
SW_I35  (via drill 0.4)
  Top 0.203: SW2.B 7.23,14.09 10.55,14.09 SW2.B' 10.86,14.19 12.02,15.34 17.14,15.34 v17.43,15.05 | X3.10 21.18,14.44 21.4,14.22 v21.4,13.72
  Route2 0.178: v21.4,13.72 18.51,13.72 17.43,14.8 v17.43,15.05
  Bottom 0.305: v17.43,15.05 16.89,14.51 R8.1
TX  (via drill 0.39)
  Top 0.203: v27.85,6.34 27.41,5.89 22.15,5.89 21.31,5.05 21.31,3.12 X3.26
  Route2 0.178: JP2.13 31.7,16.45 | v27.85,6.34 28.08,6.34
  Route2 0.203: 31.7,16.45 30.78,16.45 28.85,14.53 28.85,7.11 28.08,6.34
TXD0  (via drill 0.4)
  Top 0.203: v24.77,4.04 25.12,3.7 25.12,3.05 X3.31
  Bottom 0.178: v24.77,4.04 24.77,4.17 24.08,4.87 23.44,4.87 22.26,3.68 17.86,3.68
  Bottom 0.203: IC4.20 13.7,4.91 13.9,4.71 16.83,4.71 17.86,3.68
VBAT  (via drill 0.39)
  Route15 0.305: v5.84,6.79 4.76,7.87 3.37,7.87 0.91,10.32 0.91,10.84 0.64,11.12 0.64,15.88 JP2.1
  Bottom 0.305: JP2.1 1.27,14.48 D3.A | X1.2 v5.84,6.79
VBUS  (via drill 0.39)
  Top 0.305: X4.VBUS 4.66,10.19 4.52,10.05 3.95,10.05 v3.26,10.73 v3.26,10.74
  Route2 0.305: JP2.3 4.06,14.22 4.06,11.75 3.26,10.95 v3.26,10.74
  Bottom 0.305: C15.1 11.98,11.75 11.7,11.47 IC4.7 | C15.1 R5.2 | C15.1 11.39,14.17 D1.A 7.59,15.58 6.67,16.51 JP2.3
VBUS_DET
  Bottom 0.178: R3.2 13.77,11.98 R5.1
  Bottom 0.203: R5.1 12.2,10.59 IC4.8
VHI  (via drill 0.39)
  Top 0.305: U2.1 9.19,10.08 C7.2 7.29,10.69 6.22,10.69 v5.91,11.01
  Route2 0.305: v5.91,11.01 6.67,11.01 7.68,9.99 7.68,6.92 7.05,6.29 7.05,4.19 8.89,2.35 JP4.11
  Bottom 0.305: JP4.11 8.89,3.47 R1.2 10.38,2.41 25.15,2.41 26.73,4 26.73,9.17 24.77,11.14 IC1.5 | D3.C 4.08,14.17 D1.C 5.34,14.17 6.16,13.35 6.16,11.26 v5.91,11.01

### Text on the board
Pinguin_tBackup: BAT | G | USB | 13 | 12 | 14 | 33 | 32 | U | I2C | QT | Neo | Rst | Rst | 3V | EN | VHi | A0 | A1 | A2 | A3
Pinguin_bBackup: 13 | 12 | 14 | 33 | 32 | 7 | 5! | SCL | SDA | TX | RX | VHi Out | ItsyBitsy / ESP32 / 8M FL/2M PS | Inputs | A0 | A1 | A2 | A3 | A4 | A5 | SCK | MOSI | MISO | GND